# EAGLE schematic KS-SCH-01466-01 OSSAT OBC Dev Board Schematic (EAGLE 9.7.0)
Assembly variants: Main

## Sheet 1 of 6: Block Diagram
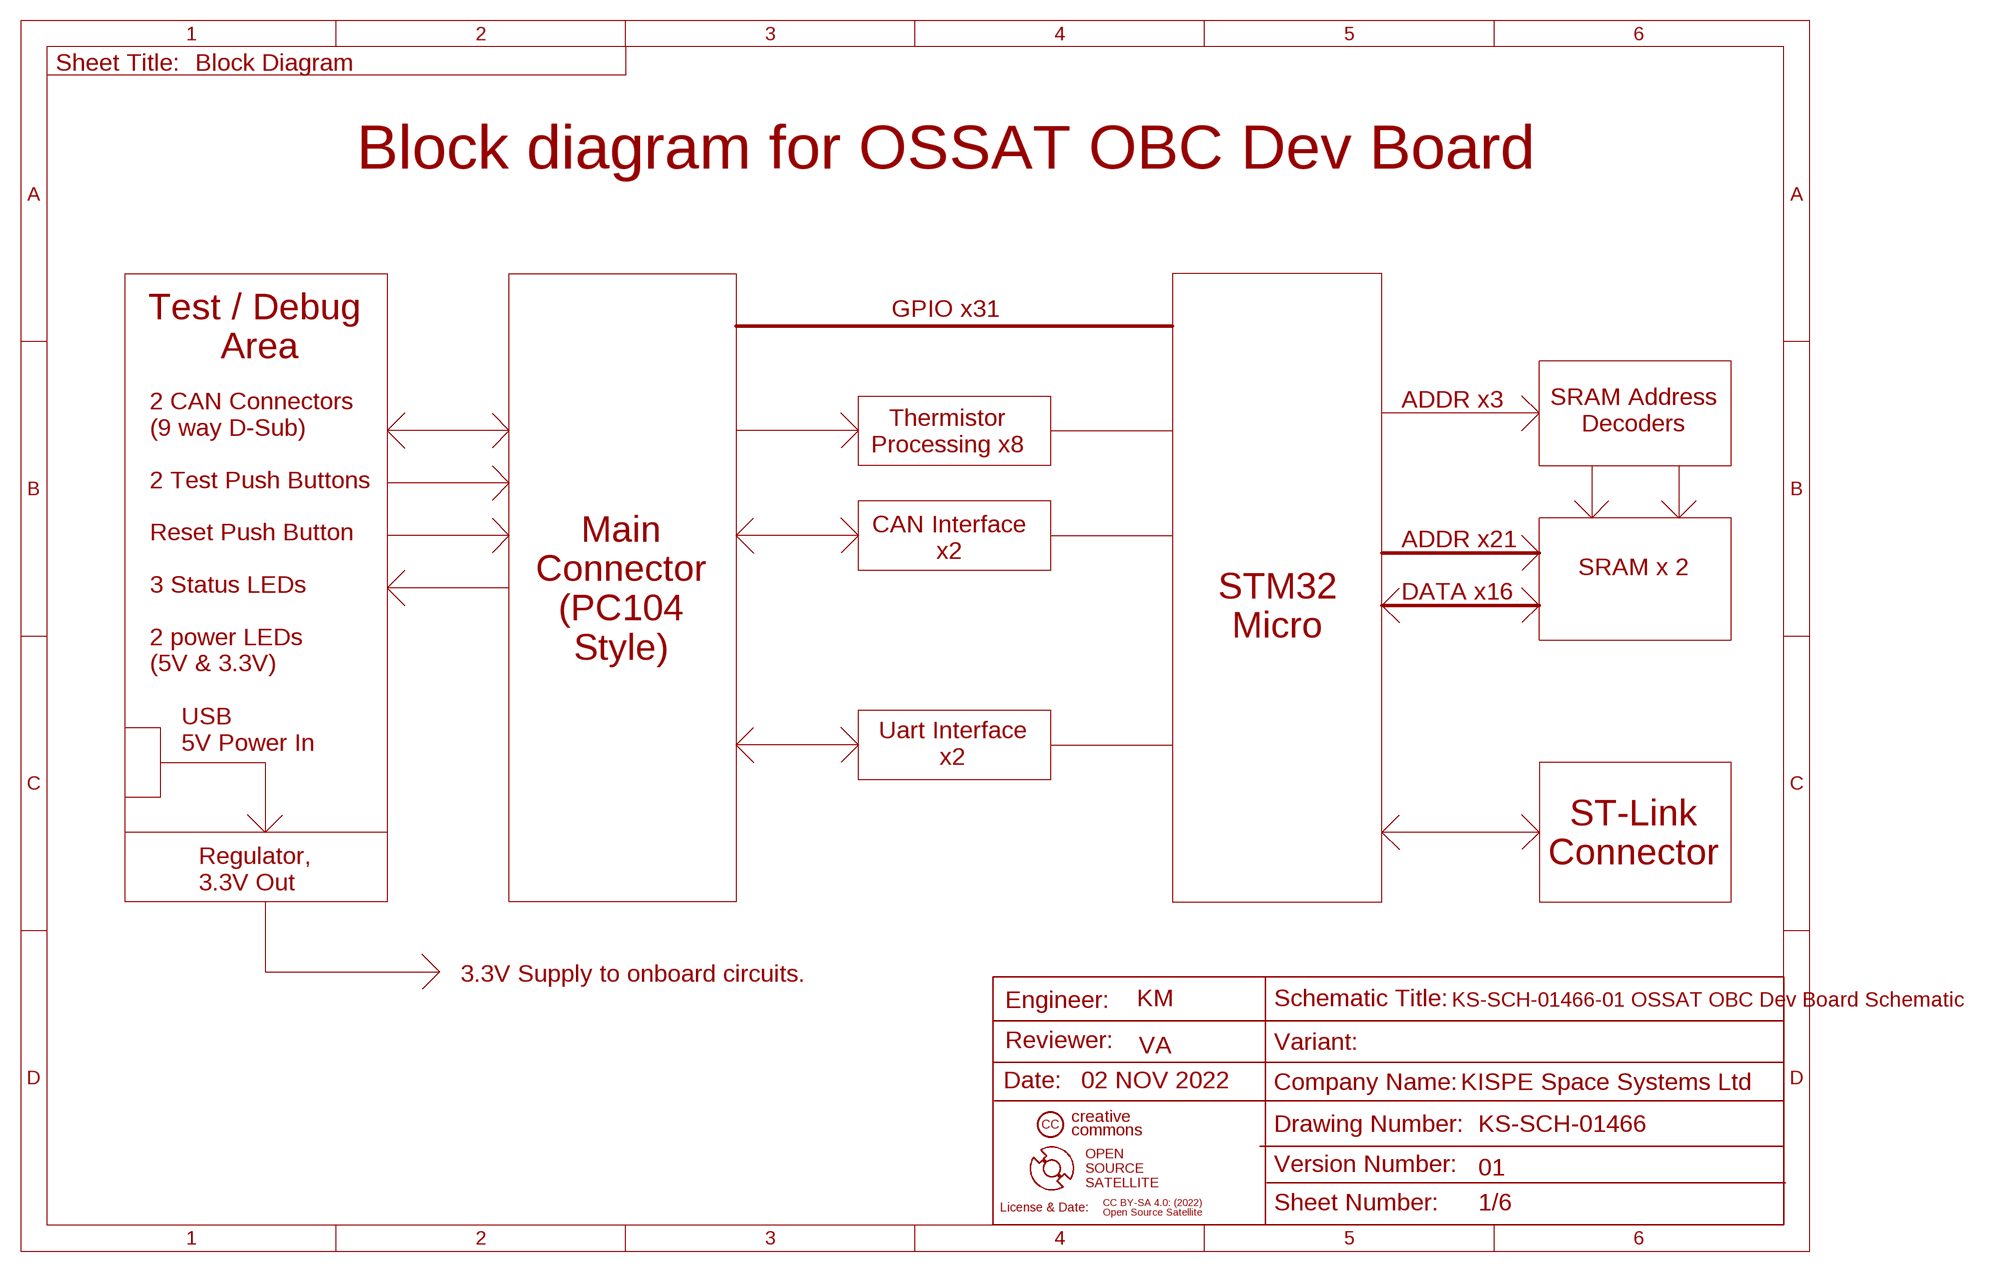
[diagram p0: schematic, sheet 1]
FRAME2 (FRAME_A4_KISPE): LICENSE_DATE: CC BY-SA 4.0: (2022)

### Notes on the sheet
- Block Diagram
- Block diagram for OSSAT OBC Dev Board
- GPIO x31
- Test / Debug
   Area
- 2 CAN Connectors
  (9 way D-Sub)
  
  2 Test Push Buttons
  
  Reset Push Button
  
  3 Status LEDs
  
  2 power LEDs
  (5V & 3.3V)
- ADDR x3
- SRAM Address
  Decoders
- Thermistor
  Processing x8
- CAN Interface
  x2
- ADDR x21
- SRAM x 2
- Main
  Connector
  (PC104
  Style)
- DATA x16
- STM32
  Micro
- USB
  5V Power In
- Uart Interface
  x2
- ST-Link
  Connector
- Regulator,
  3.3V Out
- 3.3V Supply to onboard circuits.
- KM
- VA
- 02 NOV 2022
- creative
  commons
- CC
- KS-SCH-01466
- OPEN
  SOURCE
  SATELLITE
- 01
- Open Source Satellite

## Sheet 2 of 6: Connectors & Misc
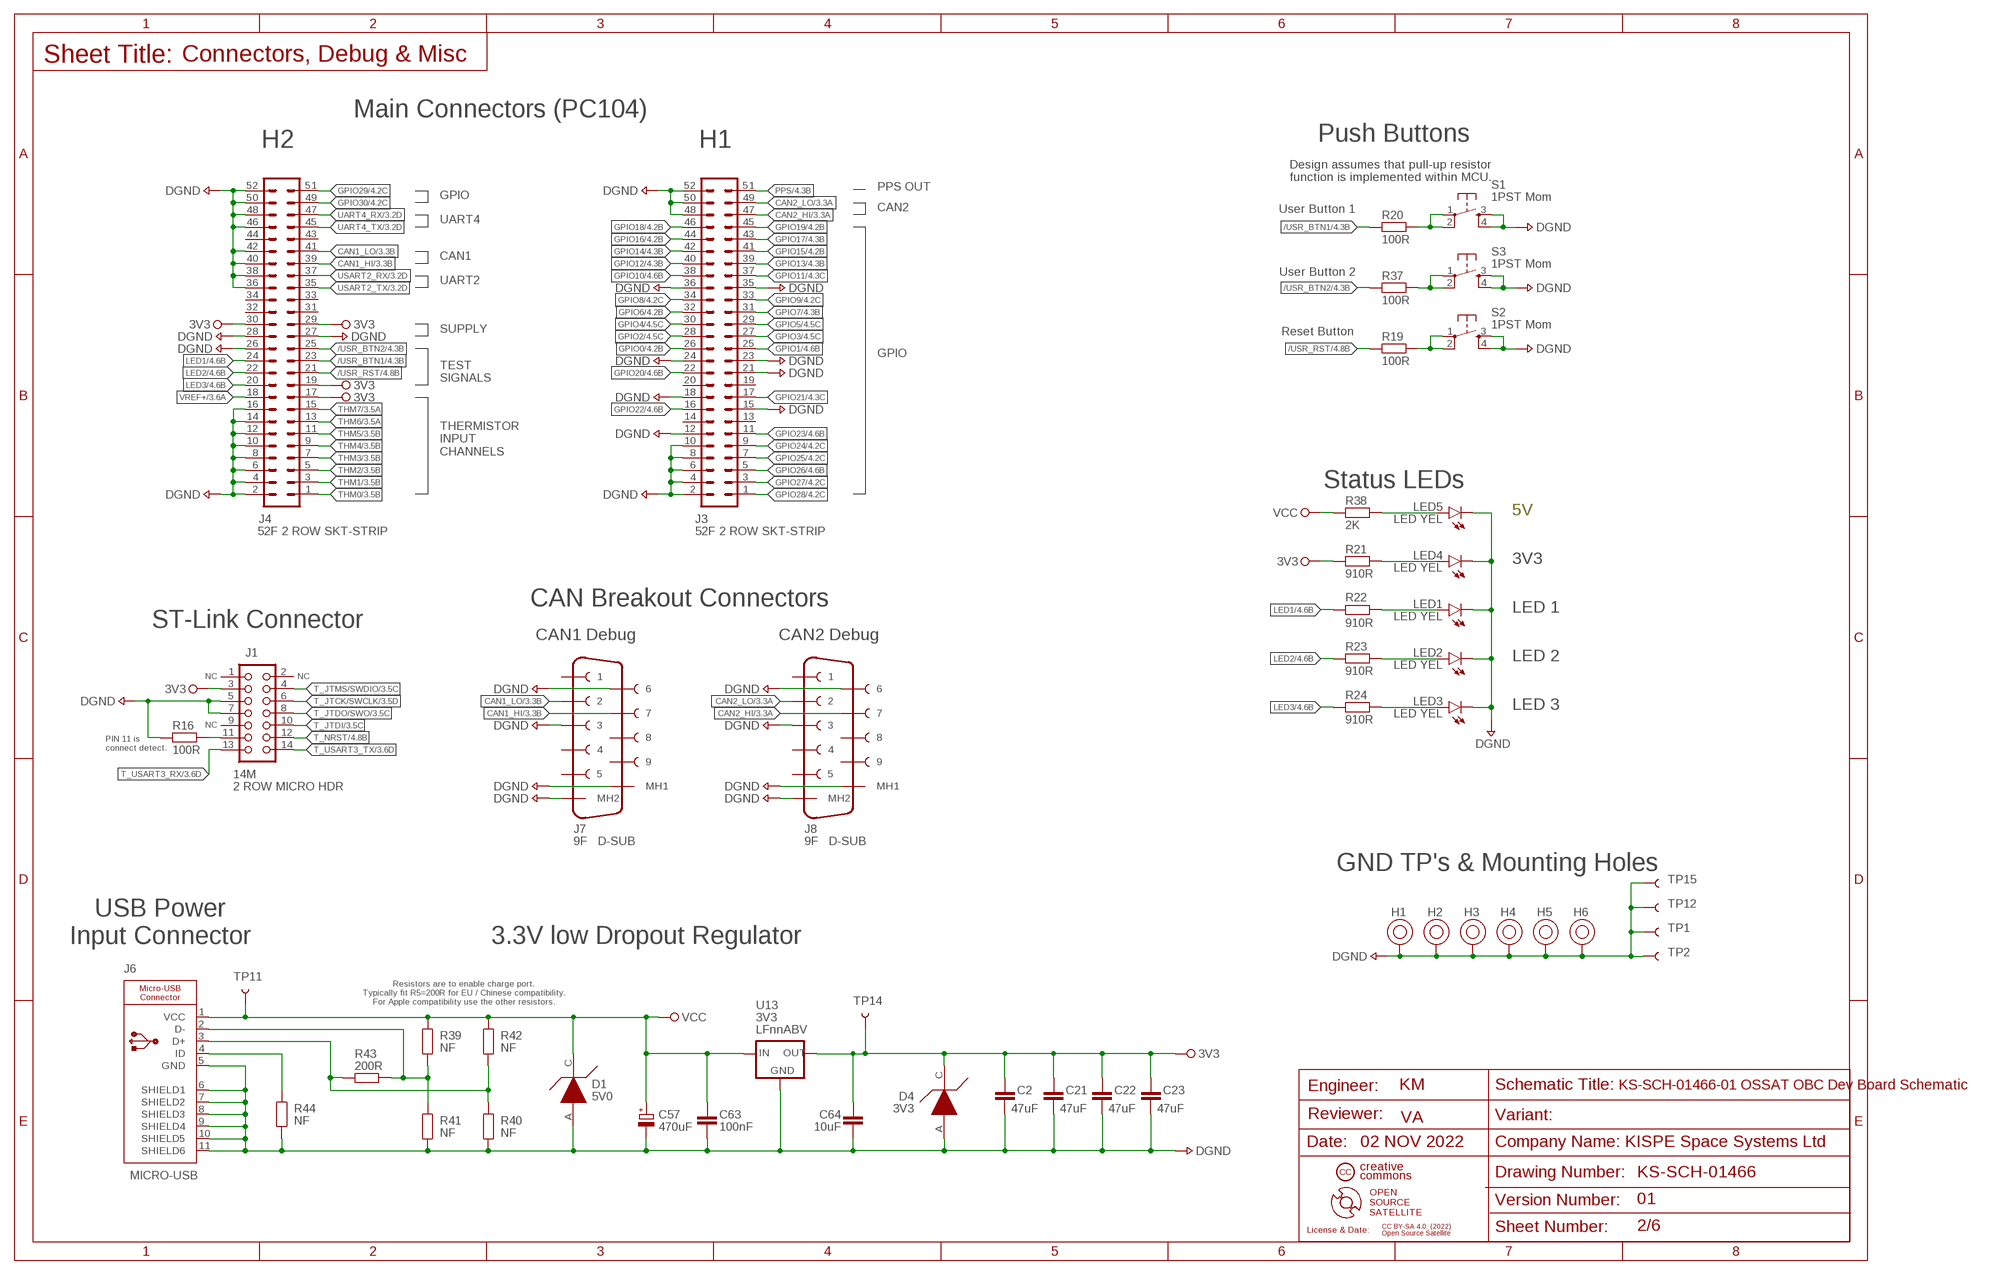
[diagram p1: schematic, sheet 2]
FRAME1 (FRAME_A3_KISPE): LICENSE_DATE: CC BY-SA 4.0: (2022)

### Parts
C2  47uF  CAPD113A_MLCC_1210_X7R_10V_10%  [CAPC3225X135_1210]
C21  47uF  CAPD113A_MLCC_1210_X7R_10V_10%  [CAPC3225X135_1210]
C22  47uF  CAPD113A_MLCC_1210_X7R_10V_10%  [CAPC3225X135_1210]
C23  47uF  CAPD113A_MLCC_1210_X7R_10V_10%  [CAPC3225X135_1210]
C57  470uF  CAPI100A_ELECTROLYTIC_16V_20%_PTH_10D_X12.5H_X5P_RUBYCON_YXF  [CAP_ELECT_RADIAL_D10_H12.5_P5]
C63  100nF  CAPC104A_MLCC_0805_X7R_50V_10%  [CAP_CHIP_0805]
C64  10uF  CAPD111B_MLCC_1210_X7R_25V_10%_Q200  [CAPC3225X135_1210]
D1  5V0  TVSD100A_TVS_CDSOD323-TNN_350W  [SOD323]
D4  3V3  TVSD100A_TVS_CDSOD323-TNN_350W  [SOD323]
H1  NF  MISH100A_HOLE_PTH_3.2_&_6.35  [HOLE-PTH-3.2-6.35]
H2  NF  MISH100A_HOLE_PTH_3.2_&_6.35  [HOLE-PTH-3.2-6.35]
H3  NF  MISH100A_HOLE_PTH_3.2_&_6.35  [HOLE-PTH-3.2-6.35]
H4  NF  MISH100A_HOLE_PTH_3.2_&_6.35  [HOLE-PTH-3.2-6.35]
H5  NF  MISH100A_HOLE_PTH_3.2_&_6.35  [HOLE-PTH-3.2-6.35]
H6  NF  MISH100A_HOLE_PTH_3.2_&_6.35  [HOLE-PTH-3.2-6.35]
J1  14M  CNRP101A_14M_2ROW_MICRO_HEADER_1.27P  [HDRV14W41P127_2X7_FTSH]
J3  52F  CNRP100A_52F_2ROW_SKT-STRIP_2.54P  [HDRVR52W64P254_2X26_6655X495X1105B]
J4  52F  CNRP100A_52F_2ROW_SKT-STRIP_2.54P  [HDRVR52W64P254_2X26_6655X495X1105B]
J6  CNRP105A_MICRO-USB_90DEG  [CON_MICRO_USB_FEMALE]
J7  9F  CNRP102A_9F_D-SUB_VERT_SCW-POST  [LD09S24A4GV00LF]
J8  9F  CNRP102A_9F_D-SUB_VERT_SCW-POST  [LD09S24A4GV00LF]
LED1  OPTL102A_LED_YELLOW_0805_120DEG  [LED_CHIP_0805]
LED2  OPTL102A_LED_YELLOW_0805_120DEG  [LED_CHIP_0805]
LED3  OPTL102A_LED_YELLOW_0805_120DEG  [LED_CHIP_0805]
LED4  OPTL102A_LED_YELLOW_0805_120DEG  [LED_CHIP_0805]
LED5  OPTL102A_LED_YELLOW_0805_120DEG  [LED_CHIP_0805]
R16  100R  RESA103B_RES_0805_0.125W_1%_AEC-Q200  [RES_CHIP_0805]
R19  100R  RESA103B_RES_0805_0.125W_1%_AEC-Q200  [RES_CHIP_0805]
R20  100R  RESA103B_RES_0805_0.125W_1%_AEC-Q200  [RES_CHIP_0805]
R21  910R  RESA103B_RES_0805_0.125W_1%_AEC-Q200  [RES_CHIP_0805]
R22  910R  RESA103B_RES_0805_0.125W_1%_AEC-Q200  [RES_CHIP_0805]
R23  910R  RESA103B_RES_0805_0.125W_1%_AEC-Q200  [RES_CHIP_0805]
R24  910R  RESA103B_RES_0805_0.125W_1%_AEC-Q200  [RES_CHIP_0805]
R37  100R  RESA103B_RES_0805_0.125W_1%_AEC-Q200  [RES_CHIP_0805]
R38  2K  RESA103B_RES_0805_0.125W_1%_AEC-Q200  [RES_CHIP_0805]
R39  NF  RESA103B_RES_0805_0.125W_1%_AEC-Q200  [RES_CHIP_0805]
R40  NF  RESA103B_RES_0805_0.125W_1%_AEC-Q200  [RES_CHIP_0805]
R41  NF  RESA103B_RES_0805_0.125W_1%_AEC-Q200  [RES_CHIP_0805]
R42  NF  RESA103B_RES_0805_0.125W_1%_AEC-Q200  [RES_CHIP_0805]
R43  200R  RESA103B_RES_0805_0.125W_1%_AEC-Q200  [RES_CHIP_0805]
R44  NF  RESA103B_RES_0805_0.125W_1%_AEC-Q200  [RES_CHIP_0805]
S1  SWTA100A_1PST_SMD_MOMENTARY_PUSH-BUTTON  [TACTILE_SWITCH_SMD_5.2MM]
S2  SWTA100A_1PST_SMD_MOMENTARY_PUSH-BUTTON  [TACTILE_SWITCH_SMD_5.2MM]
S3  SWTA100A_1PST_SMD_MOMENTARY_PUSH-BUTTON  [TACTILE_SWITCH_SMD_5.2MM]
TP1  NF  CNRT101A_TEST-POINT_1.02MM_PTH  [TP-40TH]
TP2  NF  CNRT101A_TEST-POINT_1.02MM_PTH  [TP-40TH]
TP11  NF  CNRT101A_TEST-POINT_1.02MM_PTH  [TP-40TH]
TP12  NF  CNRT101A_TEST-POINT_1.02MM_PTH  [TP-40TH]
TP14  NF  CNRT101A_TEST-POINT_1.02MM_PTH  [TP-40TH]
TP15  NF  CNRT101A_TEST-POINT_1.02MM_PTH  [TP-40TH]
U13  3V3  ICTR100A_3V3_LFNNABV_LDO_REGULATOR_TO-220  [TO220L1A]

### Nets
3V3: C2.1 C21.1 C22.1 C23.1 C64.1 D4.C(K) J1.3 J4.17 J4.19 J4.29 J4.30 R21.1 TP14.P$1 U13.3(OUT) ; also sheet 3,4,5
/USR_BTN1: J4.23 R20.2 ; also sheet 4
/USR_BTN2: J4.25 R37.2 ; also sheet 4
/USR_RST: J4.21 R19.2 ; also sheet 4
CAN1_HI: J4.39 J7.7 ; also sheet 3
CAN1_LO: J4.41 J7.2 ; also sheet 3
CAN2_HI: J3.47 J8.7 ; also sheet 3
CAN2_LO: J3.49 J8.2 ; also sheet 3
DGND: C2.2 C21.2 C22.2 C23.2 C57.2(-) C63.2 C64.2 D1.A D4.A H1.P$1 H2.P$1 H3.P$1 H4.P$1 H5.P$1 H6.P$1 J1.5 J1.7 J3.2 J3.4 J3.6 J3.8 J3.10 J3.12 J3.15 J3.18 J3.21 J3.23 J3.24 J3.35 J3.36 J3.48 J3.50 J3.52 J4.2 J4.4 J4.6 J4.8 J4.10 J4.12 J4.14 J4.16 J4.26 J4.27 J4.28 J4.36 J4.38 J4.40 J4.42 J4.46 J4.48 J4.50 J4.52 J6.5(GND) J6.6(SHIELD1) J6.7(SHIELD2) J6.8(SHIELD3) J6.9(SHIELD4) J6.10(SHIELD5) J6.11(SHIELD6) J7.3 J7.6 J7.MH1(MH2) J7.MH2(MH1) J8.3 J8.6 J8.MH1(MH2) J8.MH2(MH1) LED1.C LED2.C LED3.C LED4.C LED5.C R16.1 R40.1 R41.1 R44.1 S1.3 S1.4 S2.3 S2.4 S3.3 S3.4 TP1.P$1 TP2.P$1 TP12.P$1 TP15.P$1 U13.2(GND) ; also sheet 3,4,5
GPIO0: J3.26 ; also sheet 4
GPIO1: J3.25 ; also sheet 4
GPIO2: J3.28 ; also sheet 4
GPIO3: J3.27 ; also sheet 4
GPIO4: J3.30 ; also sheet 4
GPIO5: J3.29 ; also sheet 4
GPIO6: J3.32 ; also sheet 4
GPIO7: J3.31 ; also sheet 4
GPIO8: J3.34 ; also sheet 4
GPIO9: J3.33 ; also sheet 4
GPIO10: J3.38 ; also sheet 4
GPIO11: J3.37 ; also sheet 4
GPIO12: J3.40 ; also sheet 4
GPIO13: J3.39 ; also sheet 4
GPIO14: J3.42 ; also sheet 4
GPIO15: J3.41 ; also sheet 4
GPIO16: J3.44 ; also sheet 4
GPIO17: J3.43 ; also sheet 4
GPIO18: J3.46 ; also sheet 4
GPIO19: J3.45 ; also sheet 4
GPIO20: J3.22 ; also sheet 4
GPIO21: J3.17 ; also sheet 4
GPIO22: J3.16 ; also sheet 4
GPIO23: J3.11 ; also sheet 4
GPIO24: J3.9 ; also sheet 4
GPIO25: J3.7 ; also sheet 4
GPIO26: J3.5 ; also sheet 4
GPIO27: J3.3 ; also sheet 4
GPIO28: J3.1 ; also sheet 4
GPIO29: J4.51 ; also sheet 4
GPIO30: J4.49 ; also sheet 4
LED1: J4.24 R22.1 ; also sheet 4
LED2: J4.22 R23.1 ; also sheet 4
LED3: J4.20 R24.1 ; also sheet 4
N$23: R19.1 S2.1 S2.2
N$29: J1.11 R16.2
N$30: R20.1 S1.1 S1.2
N$32: LED4.A R21.2
N$33: LED1.A R22.2
N$34: LED2.A R23.2
N$35: LED3.A R24.2
N$36: R37.1 S3.1 S3.2
N$37: LED5.A R38.2
N$38: J6.3(D+) R40.2 R42.1 R43.1
N$39: J6.2(D-) R39.1 R41.2 R43.2
N$40: J6.4(ID) R44.2
PPS: J3.51 ; also sheet 4
T_JTCK/SWCLK: J1.6 ; also sheet 3,4
T_JTDI: J1.10 ; also sheet 3,4
T_JTDO/SWO: J1.8 ; also sheet 3
T_JTMS/SWDIO: J1.4 ; also sheet 3,4
T_NRST: J1.12 ; also sheet 4
T_USART3_RX: J1.13 ; also sheet 3,4
T_USART3_TX: J1.14 ; also sheet 3
THM0: J4.1 ; also sheet 3
THM1: J4.3 ; also sheet 3
THM2: J4.5 ; also sheet 3
THM3: J4.7 ; also sheet 3
THM4: J4.9 ; also sheet 3
THM5: J4.11 ; also sheet 3
THM6: J4.13 ; also sheet 3
THM7: J4.15 ; also sheet 3
UART4_RX: J4.47 ; also sheet 3,4
UART4_TX: J4.45 ; also sheet 3
USART2_RX: J4.37 ; also sheet 3,4
USART2_TX: J4.35 ; also sheet 3
VCC [MRAM Bus]: C57.1(+) C63.1 D1.C(K) J6.1(VCC) R38.1 R39.2 R42.2 TP11.P$1 U13.1(IN)
VREF+ [Vref]: J4.18 ; also sheet 3,4
Unconnected: J1.1 J1.2 J1.9 J3.13 J3.14 J3.19 J3.20 J4.31 J4.32 J4.33 J4.34 J4.43 J4.44 J7.1 J7.4 J7.5 J7.8 J7.9 J8.1 J8.4 J8.5 J8.8 J8.9

### Notes on the sheet
- Connectors, Debug & Misc
- Main Connectors (PC104)
- H2 | H1
- Push Buttons
- Design assumes that pull-up resistor
  function is implemented within MCU.
- GPIO | PPS OUT
- CAN2
- UART4 | User Button 1
- CAN1
- UART2 | User Button 2
- SUPPLY
- Reset Button
- GPIO
- TEST
  SIGNALS
- THERMISTOR
  INPUT
  CHANNELS
- Status LEDs
- 5V
- 3V3
- CAN Breakout Connectors
- LED 1
- ST-Link Connector
- CAN1 Debug | CAN2 Debug
- LED 2
- NC | NC
- LED 3
- NC
- PIN 11 is
  connect detect.
- GND TP's & Mounting Holes
- USB Power
  Input Connector
- 3.3V low Dropout Regulator
- Resistors are to enable charge port.
  Typically fit R5=200R for EU / Chinese compatibility.
  For Apple compatibility use the other resistors.
- KM
- VA
- 02 NOV 2022
- creative
  commons
- CC
- KS-SCH-01466
- OPEN
  SOURCE
  SATELLITE
- 01
- Open Source Satellite

## Sheet 3 of 6: Sub-System Busses
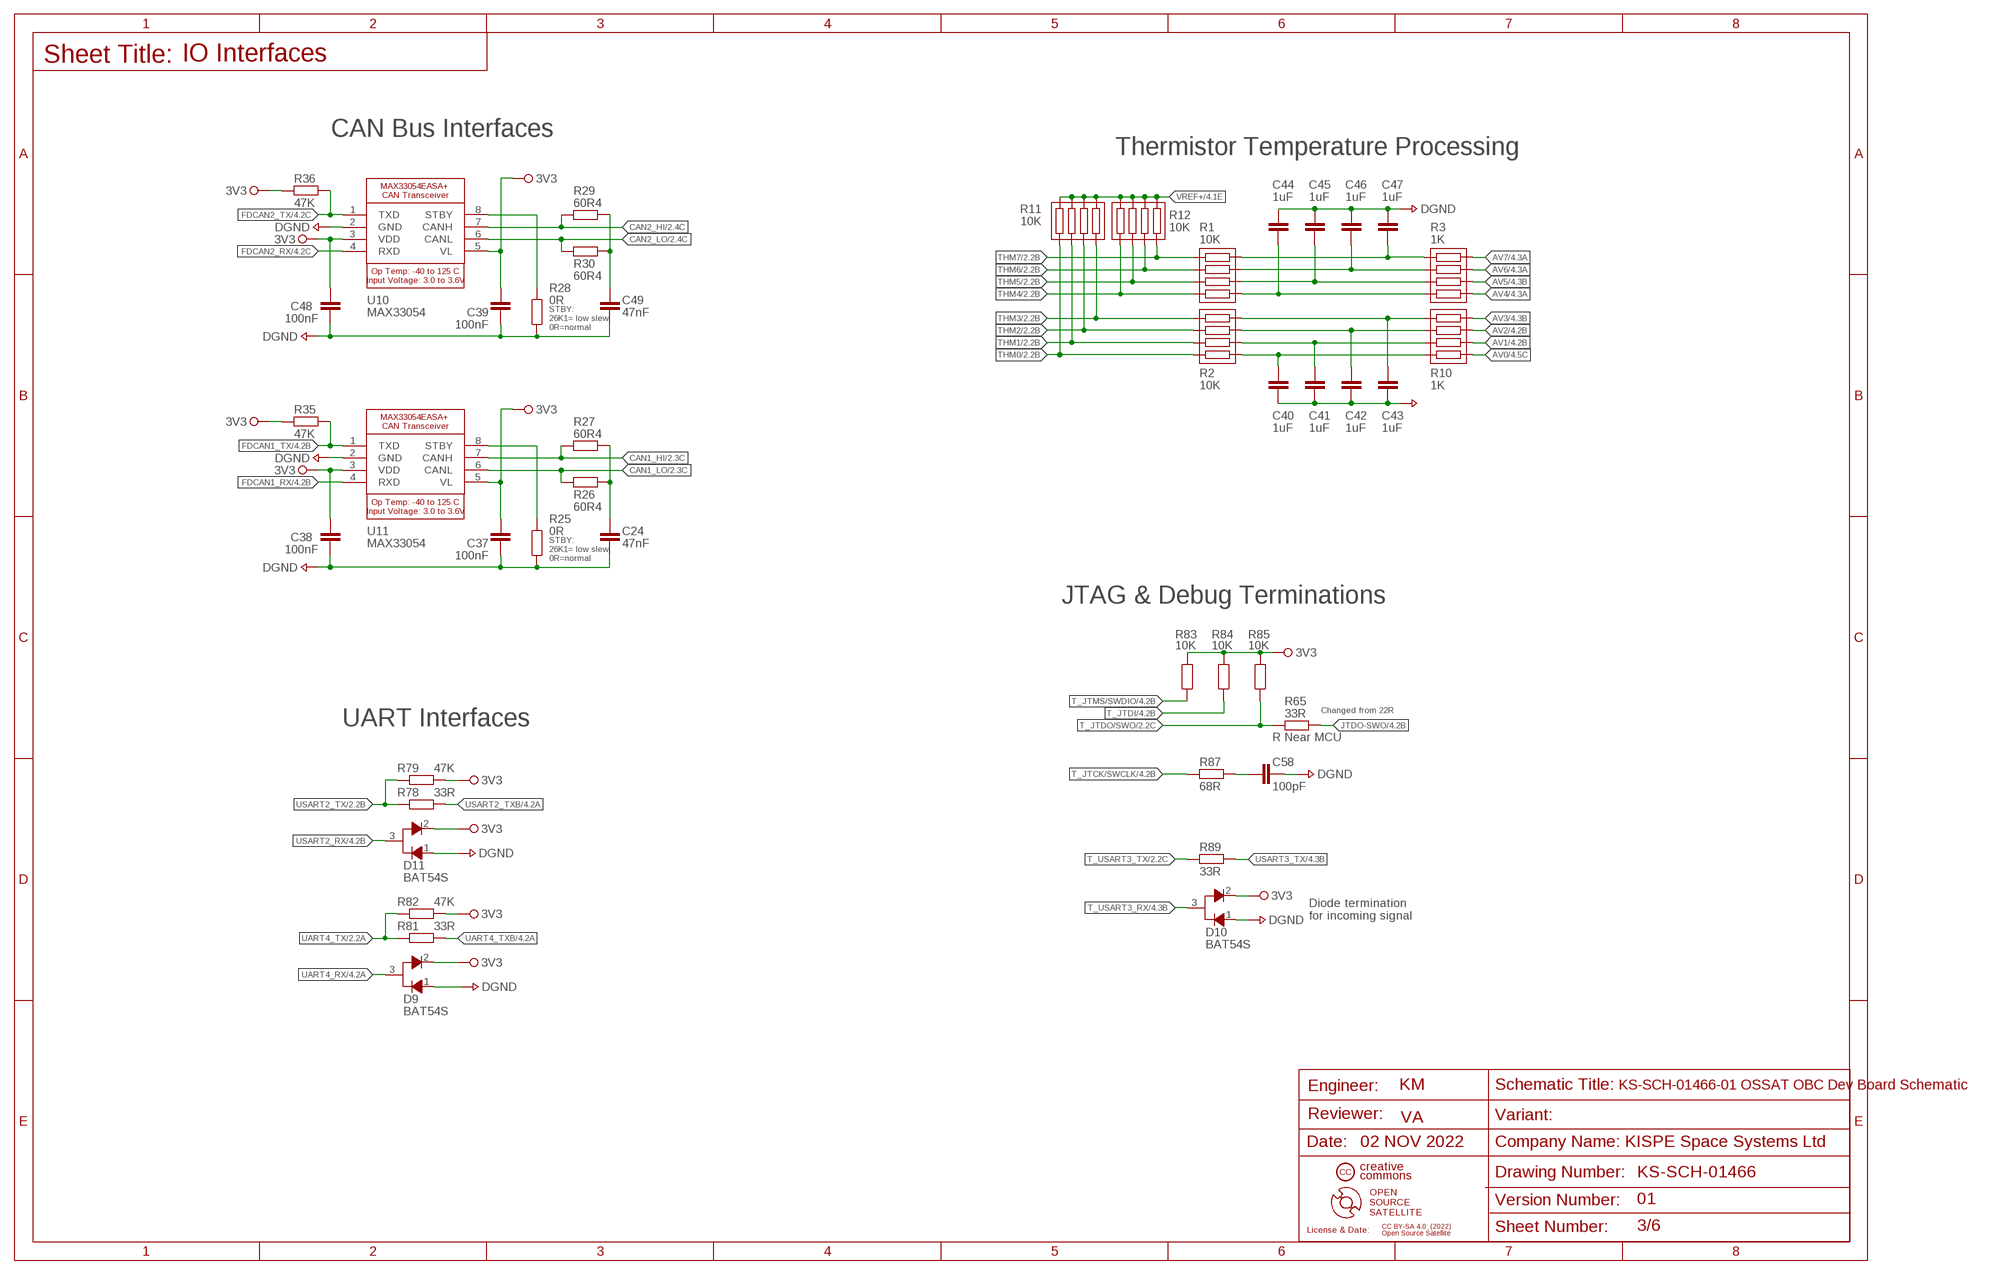
[diagram p2: schematic, sheet 3]
FRAME7 (FRAME_A3_KISPE): LICENSE_DATE: CC BY-SA 4.0: (2022)

### Parts
C24  47nF  CAPC104B_MLCC_0805_X7R_50V_10%_Q200  [CAP_CHIP_0805]
C37  100nF  CAPC104A_MLCC_0805_X7R_50V_10%  [CAP_CHIP_0805]
C38  100nF  CAPC104A_MLCC_0805_X7R_50V_10%  [CAP_CHIP_0805]
C39  100nF  CAPC104A_MLCC_0805_X7R_50V_10%  [CAP_CHIP_0805]
C40  1uF  CAPD101A_MLCC_0805_X7R_25V_10%  [CAP_CHIP_0805]
C41  1uF  CAPD101A_MLCC_0805_X7R_25V_10%  [CAP_CHIP_0805]
C42  1uF  CAPD101A_MLCC_0805_X7R_25V_10%  [CAP_CHIP_0805]
C43  1uF  CAPD101A_MLCC_0805_X7R_25V_10%  [CAP_CHIP_0805]
C44  1uF  CAPD101A_MLCC_0805_X7R_25V_10%  [CAP_CHIP_0805]
C45  1uF  CAPD101A_MLCC_0805_X7R_25V_10%  [CAP_CHIP_0805]
C46  1uF  CAPD101A_MLCC_0805_X7R_25V_10%  [CAP_CHIP_0805]
C47  1uF  CAPD101A_MLCC_0805_X7R_25V_10%  [CAP_CHIP_0805]
C48  100nF  CAPC104A_MLCC_0805_X7R_50V_10%  [CAP_CHIP_0805]
C49  47nF  CAPC104B_MLCC_0805_X7R_50V_10%_Q200  [CAP_CHIP_0805]
C58  100pF  CAPA102A_MLCC_0805_COG_50V_5%  [CAP_CHIP_0805]
D9  DIOC100A_BAT54S_DUAL_SCHOTTKY  [SOT23]
D10  DIOC100A_BAT54S_DUAL_SCHOTTKY  [SOT23]
D11  DIOC100A_BAT54S_DUAL_SCHOTTKY  [SOT23]
R1  10K  RESB100B_RES_4-ISOLATED_1206_1%_Q200  [RESCAXS80P320X160X60-8N]
R2  10K  RESB100B_RES_4-ISOLATED_1206_1%_Q200  [RESCAXS80P320X160X60-8N]
R3  1K  RESB100B_RES_4-ISOLATED_1206_1%_Q200  [RESCAXS80P320X160X60-8N]
R10  1K  RESB100B_RES_4-ISOLATED_1206_1%_Q200  [RESCAXS80P320X160X60-8N]
R11  10K  RESB100B_RES_4-ISOLATED_1206_1%_Q200  [RESCAXS80P320X160X60-8N]
R12  10K  RESB100B_RES_4-ISOLATED_1206_1%_Q200  [RESCAXS80P320X160X60-8N]
R25  0R  RESA101A_RES_0805_LINK_2A  [RES_CHIP_0805]
R26  60R4  RESA103B_RES_0805_0.125W_1%_AEC-Q200  [RES_CHIP_0805]
R27  60R4  RESA103B_RES_0805_0.125W_1%_AEC-Q200  [RES_CHIP_0805]
R28  0R  RESA101A_RES_0805_LINK_2A  [RES_CHIP_0805]
R29  60R4  RESA103B_RES_0805_0.125W_1%_AEC-Q200  [RES_CHIP_0805]
R30  60R4  RESA103B_RES_0805_0.125W_1%_AEC-Q200  [RES_CHIP_0805]
R35  47K  RESA103B_RES_0805_0.125W_1%_AEC-Q200  [RES_CHIP_0805]
R36  47K  RESA103B_RES_0805_0.125W_1%_AEC-Q200  [RES_CHIP_0805]
R65  33R  RESA103B_RES_0805_0.125W_1%_AEC-Q200  [RES_CHIP_0805]
R78  33R  RESA103B_RES_0805_0.125W_1%_AEC-Q200  [RES_CHIP_0805]
R79  47K  RESA103B_RES_0805_0.125W_1%_AEC-Q200  [RES_CHIP_0805]
R81  33R  RESA103B_RES_0805_0.125W_1%_AEC-Q200  [RES_CHIP_0805]
R82  47K  RESA103B_RES_0805_0.125W_1%_AEC-Q200  [RES_CHIP_0805]
R83  10K  RESA103B_RES_0805_0.125W_1%_AEC-Q200  [RES_CHIP_0805]
R84  10K  RESA103B_RES_0805_0.125W_1%_AEC-Q200  [RES_CHIP_0805]
R85  10K  RESA103B_RES_0805_0.125W_1%_AEC-Q200  [RES_CHIP_0805]
R87  68R  RESA103B_RES_0805_0.125W_1%_AEC-Q200  [RES_CHIP_0805]
R89  33R  RESA103B_RES_0805_0.125W_1%_AEC-Q200  [RES_CHIP_0805]
U10  ICTT100A_MAX33054EASA+_CAN-TRANCEIVER  [IC_MAX33054EASA+]
U11  ICTT100A_MAX33054EASA+_CAN-TRANCEIVER  [IC_MAX33054EASA+]

### Nets
3V3: C37.2 C38.2 C39.2 C48.2 D9.2 D10.2 D11.2 R35.2 R36.2 R79.2 R82.2 R83.2 R84.2 R85.2 U10.3(VDD) U10.5(VL) U11.3(VDD) U11.5(VL) ; also sheet 2,4,5
AV0: R10.5 ; also sheet 4
AV1: R10.6 ; also sheet 4
AV2: R10.7 ; also sheet 4
AV3: R10.8 ; also sheet 4
AV4: R3.5 ; also sheet 4
AV5: R3.6 ; also sheet 4
AV6: R3.7 ; also sheet 4
AV7: R3.8 ; also sheet 4
CAN1_HI: R27.1 U11.7(CANH) ; also sheet 2
CAN1_LO: R26.1 U11.6(CANL) ; also sheet 2
CAN2_HI: R29.1 U10.7(CANH) ; also sheet 2
CAN2_LO: R30.1 U10.6(CANL) ; also sheet 2
DGND: C24.1 C37.1 C38.1 C39.1 C40.2 C41.2 C42.2 C43.2 C44.1 C45.1 C46.1 C47.1 C48.1 C49.1 C58.2 D9.1 D10.1 D11.1 R25.1 R28.1 U10.2(GND) U11.2(GND) ; also sheet 2,4,5
FDCAN1_RX: U11.4(RXD) ; also sheet 4
FDCAN1_TX: R35.1 U11.1(TXD) ; also sheet 4
FDCAN2_RX: U10.4(RXD) ; also sheet 4
FDCAN2_TX: R36.1 U10.1(TXD) ; also sheet 4
JTDO-SWO: R65.2 ; also sheet 4
L_CSN+1: C40.1 R2.5 R10.4
L_CSN+10: C41.1 R2.6 R10.3
L_CSN+11: C42.1 R2.7 R10.2
L_CSN+12: C43.1 R2.8 R10.1
L_CSN+13: C44.2 R1.5 R3.4
L_CSN+14: C45.2 R1.6 R3.3
L_CSN+15: C46.2 R1.7 R3.2
L_CSN+16: C47.2 R1.8 R3.1
N$15: C58.1 R87.2
N$25: C24.2 R26.2 R27.2
N$26: R25.2 U11.8(STBY)
N$27: R28.2 U10.8(STBY)
N$28: C49.2 R29.2 R30.2
T_JTCK/SWCLK: R87.1 ; also sheet 2,4
T_JTDI: R84.1 ; also sheet 2,4
T_JTDO/SWO: R65.1 R85.1 ; also sheet 2
T_JTMS/SWDIO: R83.1 ; also sheet 2,4
T_USART3_RX: D10.3 ; also sheet 2,4
T_USART3_TX: R89.1 ; also sheet 2
THM0: R2.4 R11.5 ; also sheet 2
THM1: R2.3 R11.6 ; also sheet 2
THM2: R2.2 R11.7 ; also sheet 2
THM3: R2.1 R11.8 ; also sheet 2
THM4: R1.4 R12.5 ; also sheet 2
THM5: R1.3 R12.6 ; also sheet 2
THM6: R1.2 R12.7 ; also sheet 2
THM7: R1.1 R12.8 ; also sheet 2
UART4_RX: D9.3 ; also sheet 2,4
UART4_TX: R81.1 R82.1 ; also sheet 2
UART4_TXB: R81.2 ; also sheet 4
USART2_RX: D11.3 ; also sheet 2,4
USART2_TX: R78.1 R79.1 ; also sheet 2
USART2_TXB: R78.2 ; also sheet 4
USART3_TX: R89.2 ; also sheet 4
VREF+ [Vref]: R11.1 R11.2 R11.3 R11.4 R12.1 R12.2 R12.3 R12.4 ; also sheet 2,4

### Notes on the sheet
- IO Interfaces
- CAN Bus Interfaces
- Thermistor Temperature Processing
- STBY:
  26K1= low slew 
  0R=normal
- STBY:
  26K1= low slew 
  0R=normal
- JTAG & Debug Terminations
- Changed from 22R
- UART Interfaces
- R Near MCU
- Diode termination
  for incoming signal
- KM
- VA
- 02 NOV 2022
- creative
  commons
- CC
- KS-SCH-01466
- OPEN
  SOURCE
  SATELLITE
- 01
- Open Source Satellite

## Sheet 4 of 6: MCU
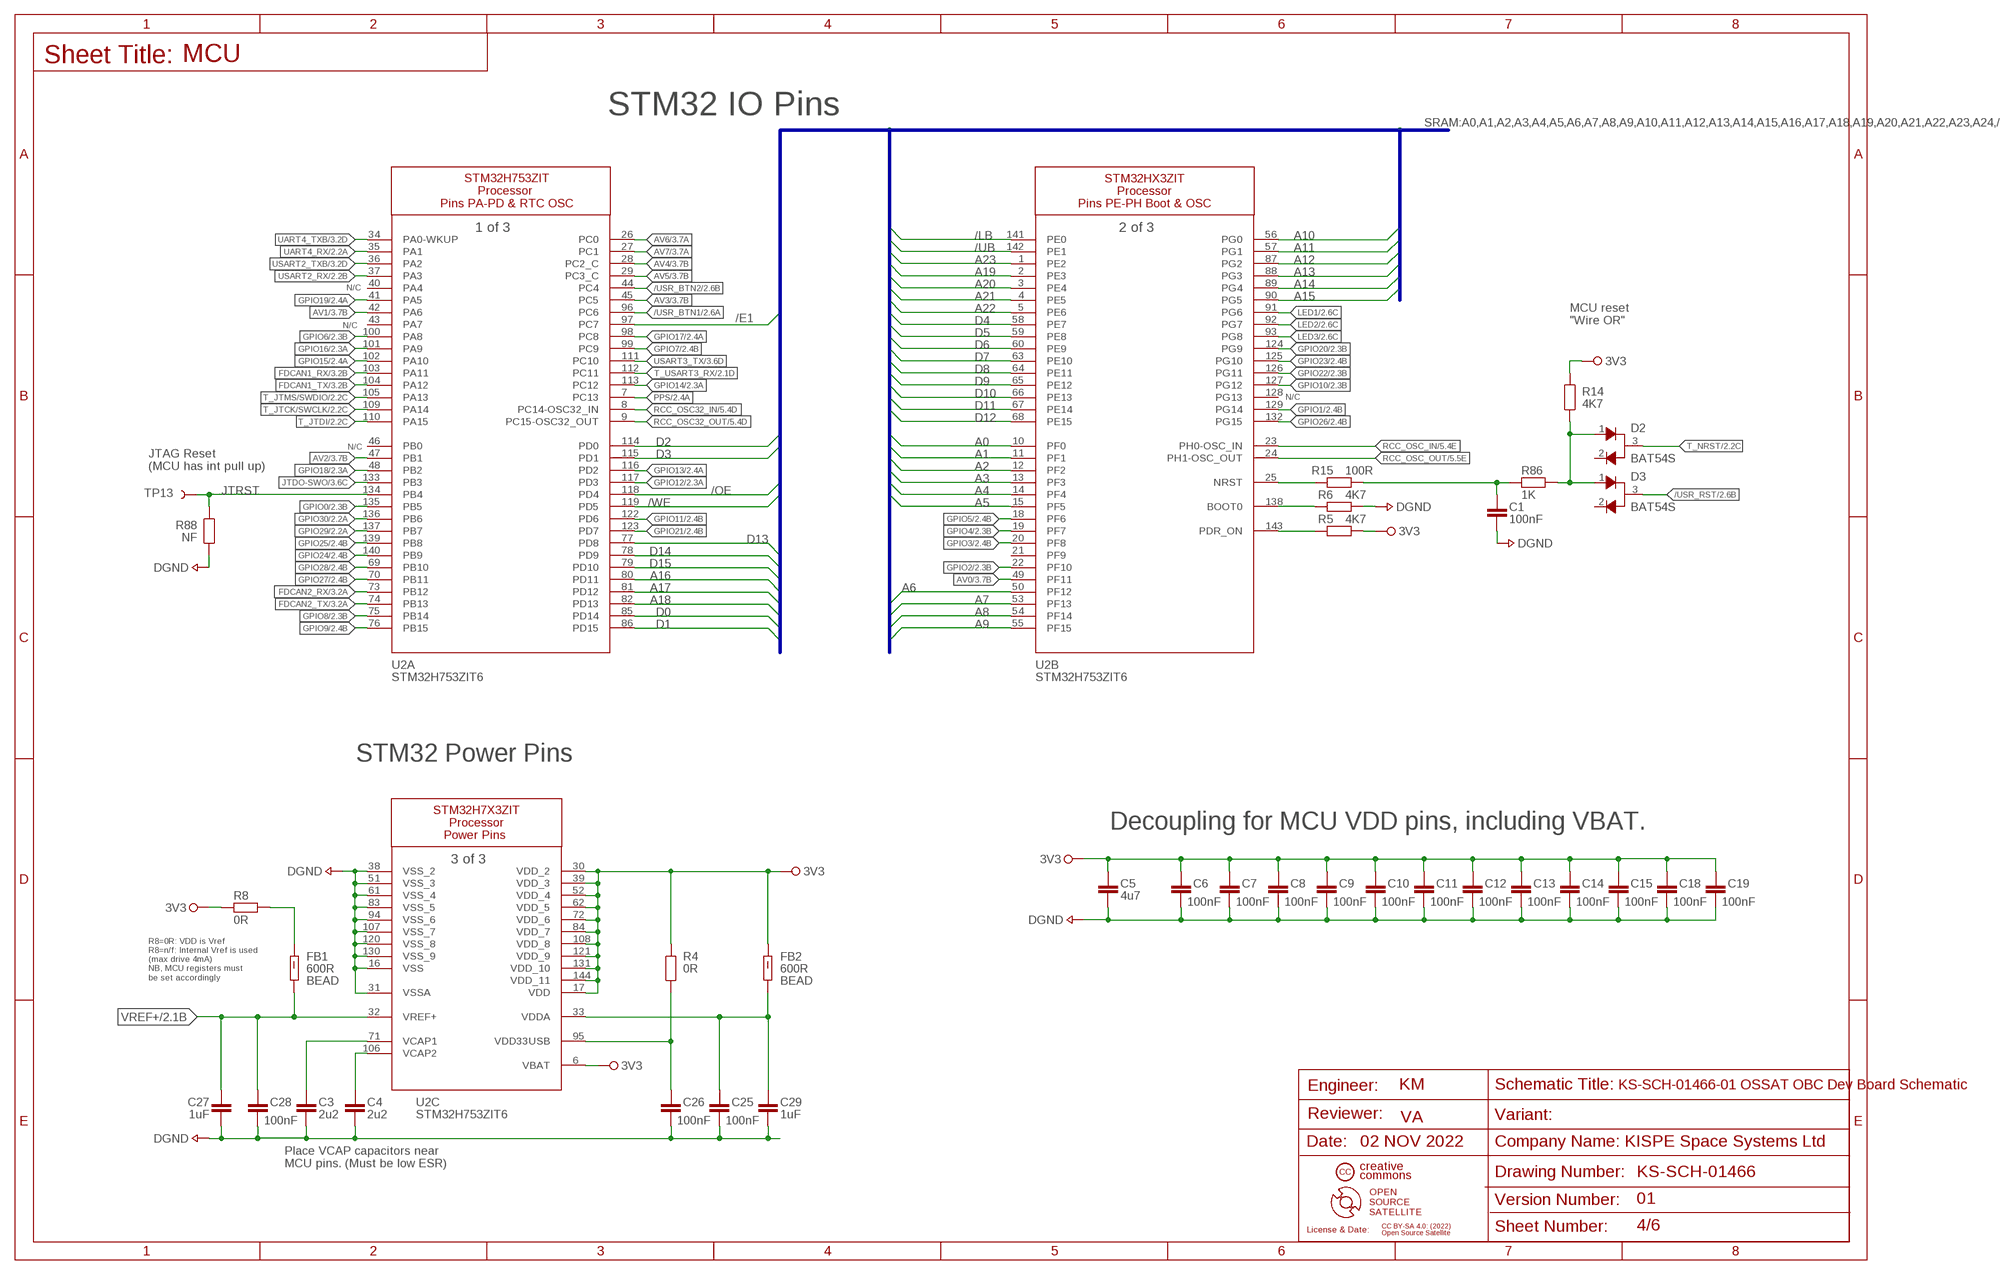
[diagram p3: schematic, sheet 4]
FRAME6 (FRAME_A3_KISPE): LICENSE_DATE: CC BY-SA 4.0: (2022)

### Parts
C1  100nF  CAPC104A_MLCC_0805_X7R_50V_10%  [CAP_CHIP_0805]
C3  2u2  CAPD102B_MLCC_0805_X7R_16V_10%_Q200  [CAP_CHIP_0805]
C4  2u2  CAPD102B_MLCC_0805_X7R_16V_10%_Q200  [CAP_CHIP_0805]
C5  4u7  CAPD102A_MLCC_0805_X7R_16V_10%  [CAP_CHIP_0805]
C6  100nF  CAPC104A_MLCC_0805_X7R_50V_10%  [CAP_CHIP_0805]
C7  100nF  CAPC104A_MLCC_0805_X7R_50V_10%  [CAP_CHIP_0805]
C8  100nF  CAPC104A_MLCC_0805_X7R_50V_10%  [CAP_CHIP_0805]
C9  100nF  CAPC104A_MLCC_0805_X7R_50V_10%  [CAP_CHIP_0805]
C10  100nF  CAPC104A_MLCC_0805_X7R_50V_10%  [CAP_CHIP_0805]
C11  100nF  CAPC104A_MLCC_0805_X7R_50V_10%  [CAP_CHIP_0805]
C12  100nF  CAPC104A_MLCC_0805_X7R_50V_10%  [CAP_CHIP_0805]
C13  100nF  CAPC104A_MLCC_0805_X7R_50V_10%  [CAP_CHIP_0805]
C14  100nF  CAPC104A_MLCC_0805_X7R_50V_10%  [CAP_CHIP_0805]
C15  100nF  CAPC104A_MLCC_0805_X7R_50V_10%  [CAP_CHIP_0805]
C18  100nF  CAPC104A_MLCC_0805_X7R_50V_10%  [CAP_CHIP_0805]
C19  100nF  CAPC104A_MLCC_0805_X7R_50V_10%  [CAP_CHIP_0805]
C25  100nF  CAPC104A_MLCC_0805_X7R_50V_10%  [CAP_CHIP_0805]
C26  100nF  CAPC104A_MLCC_0805_X7R_50V_10%  [CAP_CHIP_0805]
C27  1uF  CAPD101A_MLCC_0805_X7R_25V_10%  [CAP_CHIP_0805]
C28  100nF  CAPC104A_MLCC_0805_X7R_50V_10%  [CAP_CHIP_0805]
C29  1uF  CAPD101A_MLCC_0805_X7R_25V_10%  [CAP_CHIP_0805]
D2  DIOC100A_BAT54S_DUAL_SCHOTTKY  [SOT23]
D3  DIOC100A_BAT54S_DUAL_SCHOTTKY  [SOT23]
FB1  600R  MAGB100A_BEAD_0805_600R  [BEADC2012X105N]
FB2  600R  MAGB100A_BEAD_0805_600R  [BEADC2012X105N]
R4  0R  RESA101A_RES_0805_LINK_2A  [RES_CHIP_0805]
R5  4K7  RESA103B_RES_0805_0.125W_1%_AEC-Q200  [RES_CHIP_0805]
R6  4K7  RESA103B_RES_0805_0.125W_1%_AEC-Q200  [RES_CHIP_0805]
R8  0R  RESA101A_RES_0805_LINK_2A  [RES_CHIP_0805]
R14  4K7  RESA103B_RES_0805_0.125W_1%_AEC-Q200  [RES_CHIP_0805]
R15  100R  RESA103B_RES_0805_0.125W_1%_AEC-Q200  [RES_CHIP_0805]
R86  1K  RESA103B_RES_0805_0.125W_1%_AEC-Q200  [RES_CHIP_0805]
R88  NF  RESA103B_RES_0805_0.125W_1%_AEC-Q200  [RES_CHIP_0805]
TP13  NF  CNRT101A_TEST-POINT_1.02MM_PTH  [TP-40TH]
U2  ICTP100A_STM32H753ZIT6_MCU_144PIN  [IC_STM32H753ZIT6]

### Nets
3V3: C5.1 C6.1 C7.1 C8.1 C9.1 C10.1 C11.1 C12.1 C13.1 C14.1 C15.1 C18.1 C19.1 FB2.2 R4.2 R5.1 R8.2 R14.1 U2.6(C:VBAT) U2.17(C:VDD) U2.30(C:VDD_2) U2.39(C:VDD_3) U2.52(C:VDD_4) U2.62(C:VDD_5) U2.72(C:VDD_6) U2.84(C:VDD_7) U2.108(C:VDD_8) U2.121(C:VDD_9) U2.131(C:VDD_10) U2.144(C:VDD_11) ; also sheet 2,3,5
/E1 [MRAM Bus]: U2.97(A:PC7) ; also sheet 5
/LB [MRAM Bus]: U2.141(B:PE0) ; also sheet 5
/OE [MRAM Bus]: U2.118(A:PD4) ; also sheet 5
/UB [MRAM Bus]: U2.142(B:PE1) ; also sheet 5
/USR_BTN1: U2.96(A:PC6) ; also sheet 2
/USR_BTN2: U2.44(A:PC4) ; also sheet 2
/USR_RST: D3.3 ; also sheet 2
/WE [MRAM Bus]: U2.119(A:PD5) ; also sheet 5
A0 [MRAM Bus]: U2.10(B:PF0) ; also sheet 5
A1 [MRAM Bus]: U2.11(B:PF1) ; also sheet 5
A2 [MRAM Bus]: U2.12(B:PF2) ; also sheet 5
A3 [MRAM Bus]: U2.13(B:PF3) ; also sheet 5
A4 [MRAM Bus]: U2.14(B:PF4) ; also sheet 5
A5 [MRAM Bus]: U2.15(B:PF5) ; also sheet 5
A6 [MRAM Bus]: U2.50(B:PF12) ; also sheet 5
A7 [MRAM Bus]: U2.53(B:PF13) ; also sheet 5
A8 [MRAM Bus]: U2.54(B:PF14) ; also sheet 5
A9 [MRAM Bus]: U2.55(B:PF15) ; also sheet 5
A10 [MRAM Bus]: U2.56(B:PG0) ; also sheet 5
A11 [MRAM Bus]: U2.57(B:PG1) ; also sheet 5
A12 [MRAM Bus]: U2.87(B:PG2) ; also sheet 5
A13 [MRAM Bus]: U2.88(B:PG3) ; also sheet 5
A14 [MRAM Bus]: U2.89(B:PG4) ; also sheet 5
A15 [MRAM Bus]: U2.90(B:PG5) ; also sheet 5
A16 [MRAM Bus]: U2.80(A:PD11) ; also sheet 5
A17 [MRAM Bus]: U2.81(A:PD12) ; also sheet 5
A18 [MRAM Bus]: U2.82(A:PD13) ; also sheet 5
A19 [MRAM Bus]: U2.2(B:PE3) ; also sheet 5
A20 [MRAM Bus]: U2.3(B:PE4) ; also sheet 5
A21 [MRAM Bus]: U2.4(B:PE5) ; also sheet 5
A22 [MRAM Bus]: U2.5(B:PE6) ; also sheet 5
A23 [MRAM Bus]: U2.1(B:PE2) ; also sheet 5
AV0: U2.49(B:PF11) ; also sheet 3
AV1: U2.42(A:PA6) ; also sheet 3
AV2: U2.47(A:PB1) ; also sheet 3
AV3: U2.45(A:PC5) ; also sheet 3
AV4: U2.28(A:PC2_C) ; also sheet 3
AV5: U2.29(A:PC3_C) ; also sheet 3
AV6: U2.26(A:PC0) ; also sheet 3
AV7: U2.27(A:PC1) ; also sheet 3
BOOT0: R6.2 U2.138(B:BOOT0)
D0 [MRAM Bus]: U2.85(A:PD14) ; also sheet 5
D1 [MRAM Bus]: U2.86(A:PD15) ; also sheet 5
D2 [MRAM Bus]: U2.114(A:PD0) ; also sheet 5
D3 [MRAM Bus]: U2.115(A:PD1) ; also sheet 5
D4 [MRAM Bus]: U2.58(B:PE7) ; also sheet 5
D5 [MRAM Bus]: U2.59(B:PE8) ; also sheet 5
D6 [MRAM Bus]: U2.60(B:PE9) ; also sheet 5
D7 [MRAM Bus]: U2.63(B:PE10) ; also sheet 5
D8 [MRAM Bus]: U2.64(B:PE11) ; also sheet 5
D9 [MRAM Bus]: U2.65(B:PE12) ; also sheet 5
D10 [MRAM Bus]: U2.66(B:PE13) ; also sheet 5
D11 [MRAM Bus]: U2.67(B:PE14) ; also sheet 5
D12 [MRAM Bus]: U2.68(B:PE15) ; also sheet 5
D13 [MRAM Bus]: U2.77(A:PD8) ; also sheet 5
D14 [MRAM Bus]: U2.78(A:PD9) ; also sheet 5
D15 [MRAM Bus]: U2.79(A:PD10) ; also sheet 5
DGND: C1.2 C3.2 C4.2 C5.2 C6.2 C7.2 C8.2 C9.2 C10.2 C11.2 C12.2 C13.2 C14.2 C15.2 C18.2 C19.2 C25.2 C26.2 C27.2 C28.2 C29.2 R6.1 R88.1 U2.16(C:VSS) U2.31(C:VSSA) U2.38(C:VSS_2) U2.51(C:VSS_3) U2.61(C:VSS_4) U2.83(C:VSS_5) U2.94(C:VSS_6) U2.107(C:VSS_7) U2.120(C:VSS_8) U2.130(C:VSS_9) ; also sheet 2,3,5
FDCAN1_RX: U2.103(A:PA11) ; also sheet 3
FDCAN1_TX: U2.104(A:PA12) ; also sheet 3
FDCAN2_RX: U2.73(A:PB12) ; also sheet 3
FDCAN2_TX: U2.74(A:PB13) ; also sheet 3
GPIO0: U2.135(A:PB5) ; also sheet 2
GPIO1: U2.129(B:PG14) ; also sheet 2
GPIO2: U2.22(B:PF10) ; also sheet 2
GPIO3: U2.20(B:PF8) ; also sheet 2
GPIO4: U2.19(B:PF7) ; also sheet 2
GPIO5: U2.18(B:PF6) ; also sheet 2
GPIO6: U2.100(A:PA8) ; also sheet 2
GPIO7: U2.99(A:PC9) ; also sheet 2
GPIO8: U2.75(A:PB14) ; also sheet 2
GPIO9: U2.76(A:PB15) ; also sheet 2
GPIO10: U2.127(B:PG12) ; also sheet 2
GPIO11: U2.122(A:PD6) ; also sheet 2
GPIO12: U2.117(A:PD3) ; also sheet 2
GPIO13: U2.116(A:PD2) ; also sheet 2
GPIO14: U2.113(A:PC12) ; also sheet 2
GPIO15: U2.102(A:PA10) ; also sheet 2
GPIO16: U2.101(A:PA9) ; also sheet 2
GPIO17: U2.98(A:PC8) ; also sheet 2
GPIO18: U2.48(A:PB2) ; also sheet 2
GPIO19: U2.41(A:PA5) ; also sheet 2
GPIO20: U2.124(B:PG9) ; also sheet 2
GPIO21: U2.123(A:PD7) ; also sheet 2
GPIO22: U2.126(B:PG11) ; also sheet 2
GPIO23: U2.125(B:PG10) ; also sheet 2
GPIO24: U2.140(A:PB9) ; also sheet 2
GPIO25: U2.139(A:PB8) ; also sheet 2
GPIO26: U2.132(B:PG15) ; also sheet 2
GPIO27: U2.70(A:PB11) ; also sheet 2
GPIO28: U2.69(A:PB10) ; also sheet 2
GPIO29: U2.137(A:PB7) ; also sheet 2
GPIO30: U2.136(A:PB6) ; also sheet 2
JTDO-SWO: U2.133(A:PB3) ; also sheet 3
JTRST: R88.2 TP13.P$1 U2.134(A:PB4)
LED1: U2.91(B:PG6) ; also sheet 2
LED2: U2.92(B:PG7) ; also sheet 2
LED3: U2.93(B:PG8) ; also sheet 2
N$2: C26.1 R4.1 U2.95(C:VDD33USB)
N$6: FB1.2 R8.1
N$8: C25.1 C29.1 FB2.1 U2.33(C:VDDA)
N$11: C4.1 U2.106(C:VCAP2)
N$13: C3.1 U2.71(C:VCAP1)
N$18: R15.2 U2.25(B:NRST)
N$19: D2.1 D3.1 R14.2 R86.2
N$24: R5.2 U2.143(B:PDR_ON)
N$31: C1.1 R15.1 R86.1
PPS: U2.7(A:PC13) ; also sheet 2
RCC_OSC32_IN: U2.8(A:PC14-OSC32_IN) ; also sheet 5
RCC_OSC32_OUT: U2.9(A:PC15-OSC32_OUT) ; also sheet 5
RCC_OSC_IN: U2.23(B:PH0-OSC_IN) ; also sheet 5
RCC_OSC_OUT: U2.24(B:PH1-OSC_OUT) ; also sheet 5
T_JTCK/SWCLK: U2.109(A:PA14) ; also sheet 2,3
T_JTDI: U2.110(A:PA15) ; also sheet 2,3
T_JTMS/SWDIO: U2.105(A:PA13) ; also sheet 2,3
T_NRST: D2.3 ; also sheet 2
T_USART3_RX: U2.112(A:PC11) ; also sheet 2,3
UART4_RX: U2.35(A:PA1) ; also sheet 2,3
UART4_TXB: U2.34(A:PA0-WKUP) ; also sheet 3
USART2_RX: U2.37(A:PA3) ; also sheet 2,3
USART2_TXB: U2.36(A:PA2) ; also sheet 3
USART3_TX: U2.111(A:PC10) ; also sheet 3
VREF+ [Vref]: C27.1 C28.1 FB1.1 U2.32(C:VREF+) ; also sheet 2,3
Unconnected: D2.2 D3.2 U2.21(B:PF9) U2.40(A:PA4) U2.43(A:PA7) U2.46(A:PB0) U2.128(B:PG13)

### Buses
SRAM:A0,A1,A2,A3,A4,A5,A6,A7,A8,A9,A10,A11,A12,A13,A14,A15,A16,A17,A18,A19,A20,A21,A22,A23,A24,/CE0,/CE1,/CE2,/CE3,/CE4,/CE5,/CE6,/CE7,/CE8,/CE9,D0,D1,D2,D3,D4,D5,D6,D7,D8,D9,D10,D11,D12,D13,D14,D15,/E1,/LB,/OE,/UB,/WE

### Notes on the sheet
- MCU
- STM32 IO Pins
- N/C
- MCU reset
  "Wire OR"
- N/C
- N/C
- N/C
- JTAG Reset
  (MCU has int pull up)
- STM32 Power Pins
- Decoupling for MCU VDD pins, including VBAT.
- R8=0R: VDD is Vref
  R8=n/f: Internal Vref is used
  (max drive 4mA)
  NB, MCU registers must
  be set accordingly
- KM
- VA
- 02 NOV 2022
- Place VCAP capacitors near
  MCU pins. (Must be low ESR)
- creative
  commons
- CC
- KS-SCH-01466
- OPEN
  SOURCE
  SATELLITE
- 01
- Open Source Satellite

## Sheet 5 of 6: MRAM & OSCILLATORS
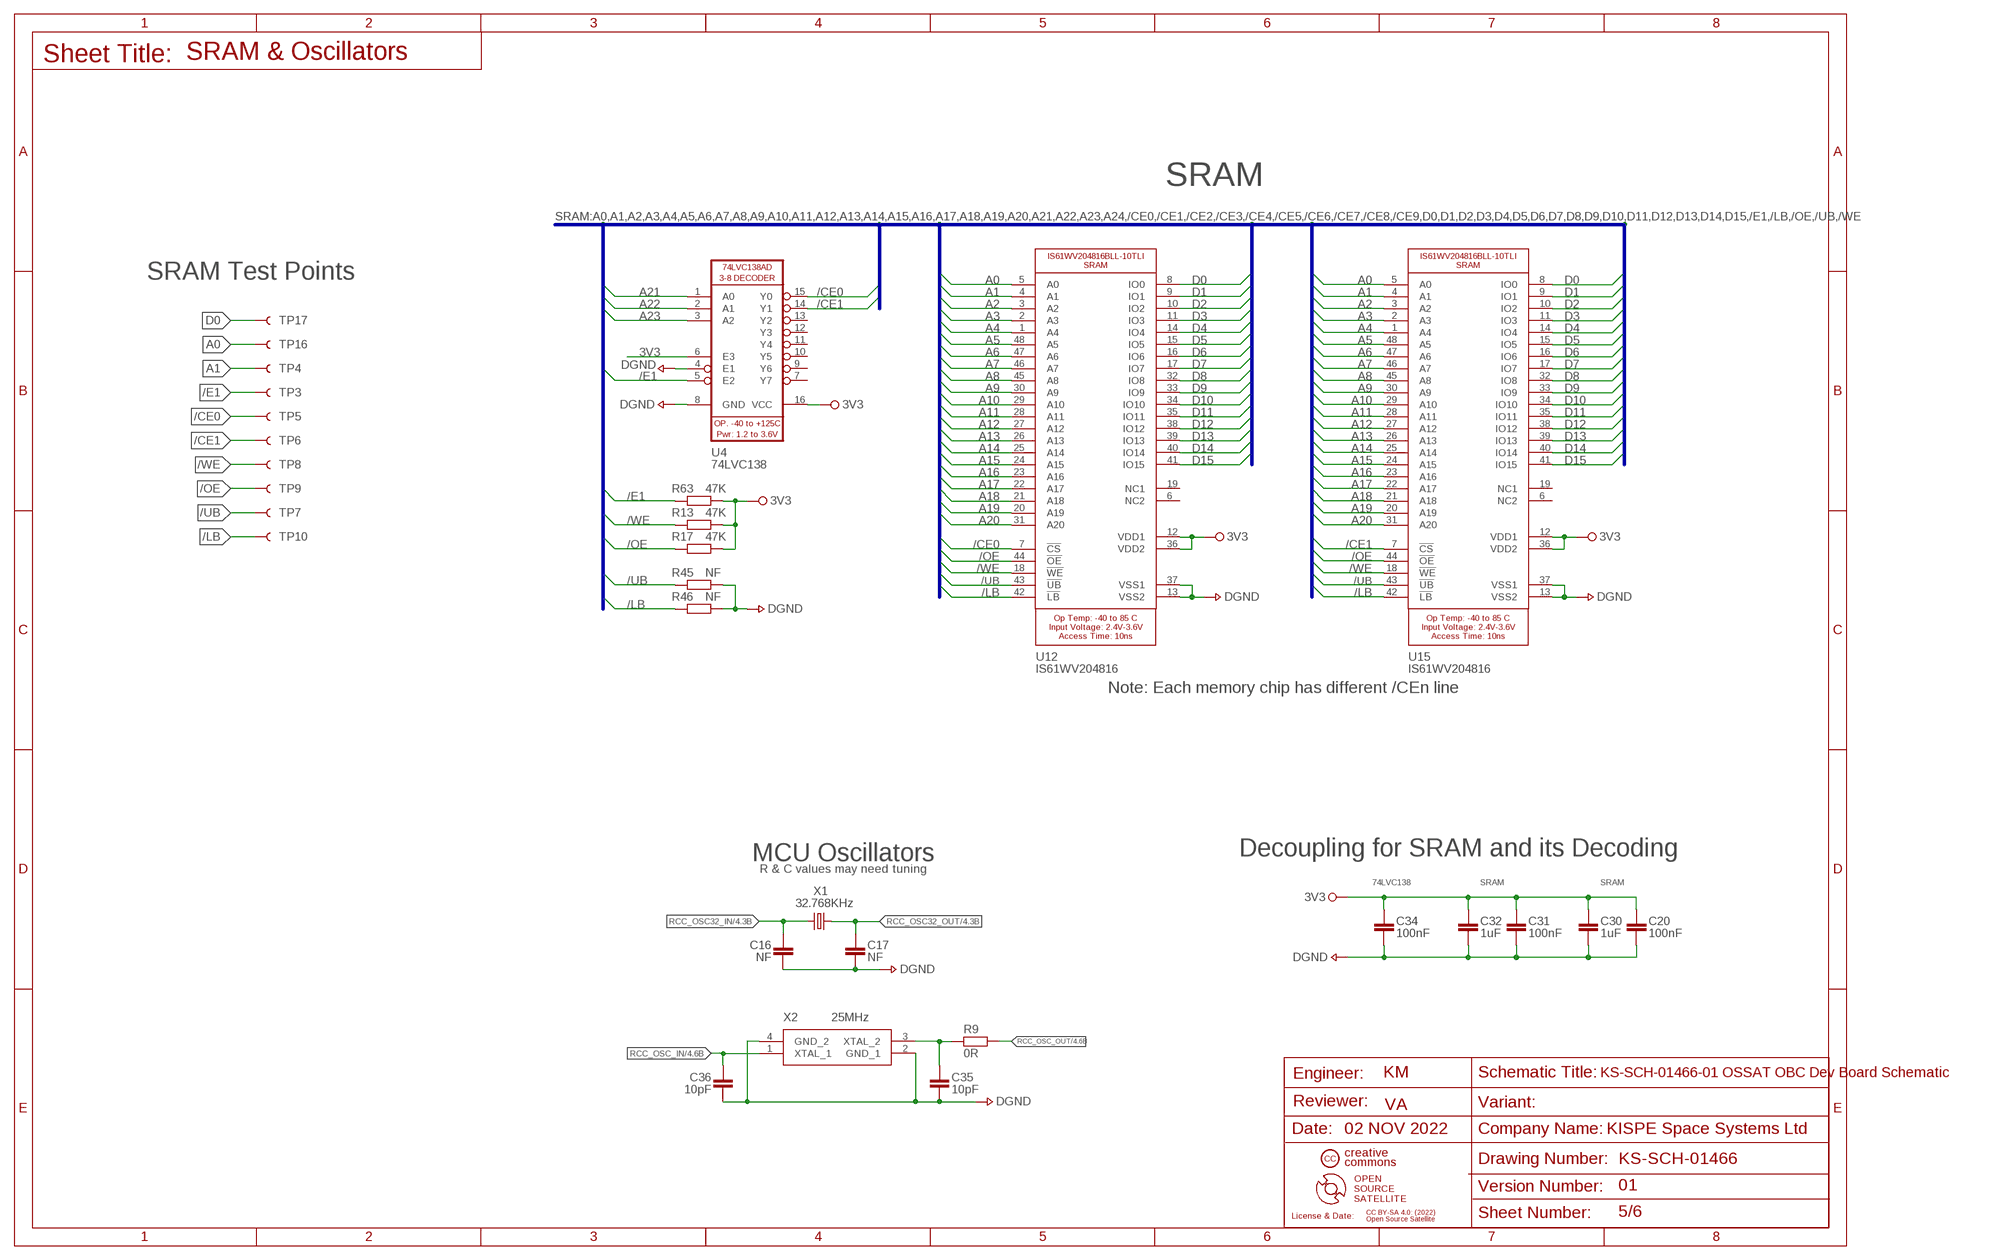
[diagram p4: schematic, sheet 5]
FRAME5 (FRAME_A3_KISPE): LICENSE_DATE: CC BY-SA 4.0: (2022)

### Parts
C16  NF  CAPA103A_MLCC_0805_COG_50V_10%  [CAP_CHIP_0805]
C17  NF  CAPA103A_MLCC_0805_COG_50V_10%  [CAP_CHIP_0805]
C20  100nF  CAPC104A_MLCC_0805_X7R_50V_10%  [CAP_CHIP_0805]
C30  1uF  CAPD101A_MLCC_0805_X7R_25V_10%  [CAP_CHIP_0805]
C31  100nF  CAPC104A_MLCC_0805_X7R_50V_10%  [CAP_CHIP_0805]
C32  1uF  CAPD101A_MLCC_0805_X7R_25V_10%  [CAP_CHIP_0805]
C34  100nF  CAPC104A_MLCC_0805_X7R_50V_10%  [CAP_CHIP_0805]
C35  10pF  CAPA102B_MLCC_0805_COG_50V_5%_Q200  [CAP_CHIP_0805]
C36  10pF  CAPA102B_MLCC_0805_COG_50V_5%_Q200  [CAP_CHIP_0805]
R9  0R  RESA101A_RES_0805_LINK_2A  [RES_CHIP_0805]
R13  47K  RESA103B_RES_0805_0.125W_1%_AEC-Q200  [RES_CHIP_0805]
R17  47K  RESA103B_RES_0805_0.125W_1%_AEC-Q200  [RES_CHIP_0805]
R45  NF  RESA103B_RES_0805_0.125W_1%_AEC-Q200  [RES_CHIP_0805]
R46  NF  RESA103B_RES_0805_0.125W_1%_AEC-Q200  [RES_CHIP_0805]
R63  47K  RESA103B_RES_0805_0.125W_1%_AEC-Q200  [RES_CHIP_0805]
TP3  NF  CNRT101A_TEST-POINT_1.02MM_PTH  [TP-40TH]
TP4  NF  CNRT101A_TEST-POINT_1.02MM_PTH  [TP-40TH]
TP5  NF  CNRT101A_TEST-POINT_1.02MM_PTH  [TP-40TH]
TP6  NF  CNRT101A_TEST-POINT_1.02MM_PTH  [TP-40TH]
TP7  NF  CNRT101A_TEST-POINT_1.02MM_PTH  [TP-40TH]
TP8  NF  CNRT101A_TEST-POINT_1.02MM_PTH  [TP-40TH]
TP9  NF  CNRT101A_TEST-POINT_1.02MM_PTH  [TP-40TH]
TP10  NF  CNRT101A_TEST-POINT_1.02MM_PTH  [TP-40TH]
TP16  NF  CNRT101A_TEST-POINT_1.02MM_PTH  [TP-40TH]
TP17  NF  CNRT101A_TEST-POINT_1.02MM_PTH  [TP-40TH]
U4  ICTL100A_74LVC138AD_3-8_DECODER  [SOIC-16]
U12  ICTM101A_IS61WV204816BLL-10TLI_SRAM_4MBYTE  [IS61WV204816BLL-10TLI]
U15  ICTM101A_IS61WV204816BLL-10TLI_SRAM_4MBYTE  [IS61WV204816BLL-10TLI]
X1  OSCC100A_XTAL_32.768KHZ_12P5  [XTAL_NX3215SA]
X2  OSCC102A_XTAL_25MHZ_10PF  [XTAL_NX2016SA]

### Nets
3V3: C20.1 C30.1 C31.1 C32.1 C34.1 R13.2 R17.2 R63.2 U4.6(E3) U4.16(VCC) U12.12(VDD1) U12.36(VDD2) U15.12(VDD1) U15.36(VDD2) ; also sheet 2,3,4
/CE0 [MRAM Bus]: TP5.P$1 U4.15(Y0) U12.7(!CS)
/CE1 [MRAM Bus]: TP6.P$1 U4.14(Y1) U15.7(!CS)
/E1 [MRAM Bus]: R63.1 TP3.P$1 U4.5(E2) ; also sheet 4
/LB [MRAM Bus]: R46.1 TP10.P$1 U12.42(!LB) U15.42(!LB) ; also sheet 4
/OE [MRAM Bus]: R17.1 TP9.P$1 U12.44(!OE) U15.44(!OE) ; also sheet 4
/UB [MRAM Bus]: R45.1 TP7.P$1 U12.43(!UB) U15.43(!UB) ; also sheet 4
/WE [MRAM Bus]: R13.1 TP8.P$1 U12.18(!WE) U15.18(!WE) ; also sheet 4
A0 [MRAM Bus]: TP16.P$1 U12.5(A0) U15.5(A0) ; also sheet 4
A1 [MRAM Bus]: TP4.P$1 U12.4(A1) U15.4(A1) ; also sheet 4
A2 [MRAM Bus]: U12.3(A2) U15.3(A2) ; also sheet 4
A3 [MRAM Bus]: U12.2(A3) U15.2(A3) ; also sheet 4
A4 [MRAM Bus]: U12.1(A4) U15.1(A4) ; also sheet 4
A5 [MRAM Bus]: U12.48(A5) U15.48(A5) ; also sheet 4
A6 [MRAM Bus]: U12.47(A6) U15.47(A6) ; also sheet 4
A7 [MRAM Bus]: U12.46(A7) U15.46(A7) ; also sheet 4
A8 [MRAM Bus]: U12.45(A8) U15.45(A8) ; also sheet 4
A9 [MRAM Bus]: U12.30(A9) U15.30(A9) ; also sheet 4
A10 [MRAM Bus]: U12.29(A10) U15.29(A10) ; also sheet 4
A11 [MRAM Bus]: U12.28(A11) U15.28(A11) ; also sheet 4
A12 [MRAM Bus]: U12.27(A12) U15.27(A12) ; also sheet 4
A13 [MRAM Bus]: U12.26(A13) U15.26(A13) ; also sheet 4
A14 [MRAM Bus]: U12.25(A14) U15.25(A14) ; also sheet 4
A15 [MRAM Bus]: U12.24(A15) U15.24(A15) ; also sheet 4
A16 [MRAM Bus]: U12.23(A16) U15.23(A16) ; also sheet 4
A17 [MRAM Bus]: U12.22(A17) U15.22(A17) ; also sheet 4
A18 [MRAM Bus]: U12.21(A18) U15.21(A18) ; also sheet 4
A19 [MRAM Bus]: U12.20(A19) U15.20(A19) ; also sheet 4
A20 [MRAM Bus]: U12.31(A20) U15.31(A20) ; also sheet 4
A21 [MRAM Bus]: U4.1(A0) ; also sheet 4
A22 [MRAM Bus]: U4.2(A1) ; also sheet 4
A23 [MRAM Bus]: U4.3(A2) ; also sheet 4
D0 [MRAM Bus]: TP17.P$1 U12.8(IO0) U15.8(IO0) ; also sheet 4
D1 [MRAM Bus]: U12.9(IO1) U15.9(IO1) ; also sheet 4
D2 [MRAM Bus]: U12.10(IO2) U15.10(IO2) ; also sheet 4
D3 [MRAM Bus]: U12.11(IO3) U15.11(IO3) ; also sheet 4
D4 [MRAM Bus]: U12.14(IO4) U15.14(IO4) ; also sheet 4
D5 [MRAM Bus]: U12.15(IO5) U15.15(IO5) ; also sheet 4
D6 [MRAM Bus]: U12.16(IO6) U15.16(IO6) ; also sheet 4
D7 [MRAM Bus]: U12.17(IO7) U15.17(IO7) ; also sheet 4
D8 [MRAM Bus]: U12.32(IO8) U15.32(IO8) ; also sheet 4
D9 [MRAM Bus]: U12.33(IO9) U15.33(IO9) ; also sheet 4
D10 [MRAM Bus]: U12.34(IO10) U15.34(IO10) ; also sheet 4
D11 [MRAM Bus]: U12.35(IO11) U15.35(IO11) ; also sheet 4
D12 [MRAM Bus]: U12.38(IO12) U15.38(IO12) ; also sheet 4
D13 [MRAM Bus]: U12.39(IO13) U15.39(IO13) ; also sheet 4
D14 [MRAM Bus]: U12.40(IO14) U15.40(IO14) ; also sheet 4
D15 [MRAM Bus]: U12.41(IO15) U15.41(IO15) ; also sheet 4
DGND: C16.2 C17.2 C20.2 C30.2 C31.2 C32.2 C34.2 C35.2 C36.2 R45.2 R46.2 U4.4(E1) U4.8(GND) U12.13(VSS2) U12.37(VSS1) U15.13(VSS2) U15.37(VSS1) X2.2(GND_1) X2.4(GND_2) ; also sheet 2,3,4
N$10: C35.1 R9.2 X2.3(XTAL_2)
RCC_OSC32_IN: C16.1 X1.2 ; also sheet 4
RCC_OSC32_OUT: C17.1 X1.1 ; also sheet 4
RCC_OSC_IN: C36.1 X2.1(XTAL_1) ; also sheet 4
RCC_OSC_OUT: R9.1 ; also sheet 4
Unconnected: U4.7(Y7) U4.9(Y6) U4.10(Y5) U4.11(Y4) U4.12(Y3) U4.13(Y2) U12.6(NC2) U12.19(NC1) U15.6(NC2) U15.19(NC1)

### Buses
SRAM:A0,A1,A2,A3,A4,A5,A6,A7,A8,A9,A10,A11,A12,A13,A14,A15,A16,A17,A18,A19,A20,A21,A22,A23,A24,/CE0,/CE1,/CE2,/CE3,/CE4,/CE5,/CE6,/CE7,/CE8,/CE9,D0,D1,D2,D3,D4,D5,D6,D7,D8,D9,D10,D11,D12,D13,D14,D15,/E1,/LB,/OE,/UB,/WE

### Notes on the sheet
- SRAM & Oscillators
- SRAM
- SRAM Test Points
- Note: Each memory chip has different /CEn line
- MCU Oscillators | Decoupling for SRAM and its Decoding
- R & C values may need tuning
- 74LVC138 | SRAM | SRAM
- KM
- VA
- 02 NOV 2022
- creative
  commons
- CC
- KS-SCH-01466
- OPEN
  SOURCE
  SATELLITE
- 01
- Open Source Satellite

## Sheet 6 of 6: Revision History
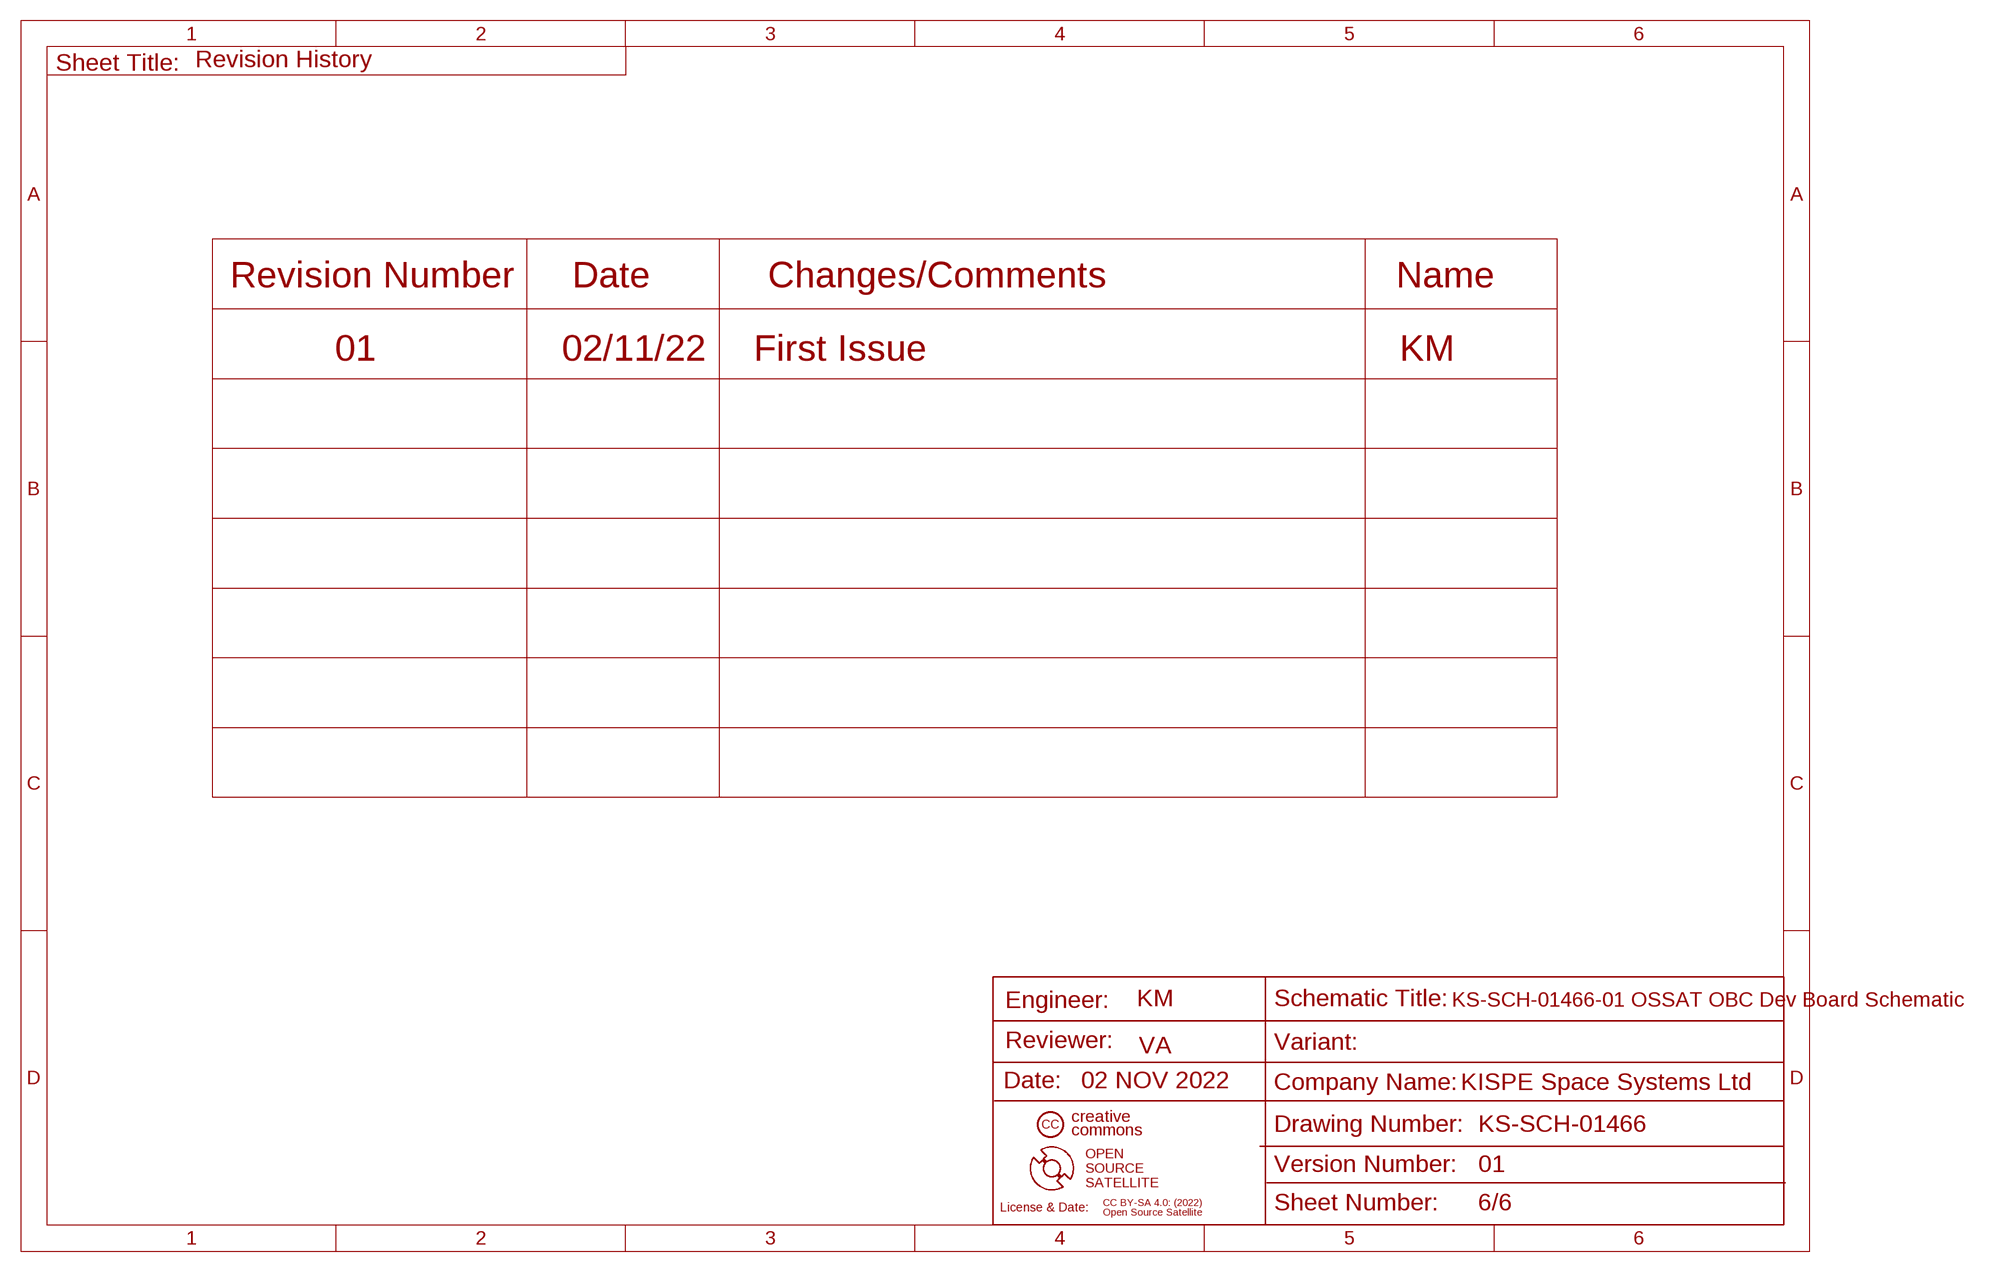
[diagram p5: schematic, sheet 6]
FRAME3 (FRAME_A4_KISPE): LICENSE_DATE: CC BY-SA 4.0: (2022)

### Notes on the sheet
- Revision History
- Revision Number | Date | Changes/Comments | Name
- 01 | 02/11/22 | First Issue | KM
- KM
- VA
- 02 NOV 2022
- creative
  commons
- CC
- KS-SCH-01466
- OPEN
  SOURCE
  SATELLITE
- 01
- Open Source Satellite

## Library data of the parts
C1 C6-C15 C18-C20 C25 C26 C28 C31 C34 C37-C39 C48 C63 = KSP-CAP:CAPC104A: MLCC 0805 X7R 50V 10%
C2 C21-C23 = KSP-CAP:CAPD113A: MLCC 1210 X7R 10V 10%
C3 C4 = KSP-CAP:CAPD102B: MLCC 0805 X7R 16V 10% Q200
C5 = KSP-CAP:CAPD102A: MLCC 0805 X7R 16V 10%
C16 C17 = KSP-CAP:CAPA103A: MLCC 0805 COG 50V 10%
C24 C49 = KSP-CAP:CAPC104B: MLCC 0805 X7R 50V 10% Q200
C27 C29 C30 C32 C40-C47 = KSP-CAP:CAPD101A: MLCC 0805 X7R 25V 10%
C35 C36 = KSP-CAP:CAPA102B: MLCC 0805 COG 50V 5% Q200
C57 = KSP-CAP:CAPI100A: ELECTROLYTIC 16V 20% PTH 10Dx12.5Hx5P Rubycon YXF
C58 = KSP-CAP:CAPA102A: MLCC 0805 COG 50V 5%
C64 = KSP-CAP:CAPD111B: MLCC 1210 X7R 25V 10% Q200
D1 D4 = KSP-TVS:TVSD100A: TVS CDSOD323-Tnn 350W; TYPE: CDSOD323
D2 D3 D9-D11 = KSP-DIO:DIOC100A: BAT54S Dual Schottky SOT23 diodes in series; TYPE: BAT54S
FB1 FB2 = KSP-MAG:MAGB100A: Bead 0805 600R at 100MHz WE-CBF-SMD; TYPE: BEAD
H1-H6 = KSP-MIS:MISH100A: HOLE PTH 3.2 & 6.35; TYPE: 3.2D & 6.35
J1 = KSP-CNR:CNRP101A: 2 Row Micro Header 1.27p Samtec FTSH-1nn-01-F-D-K; TYPE: 2 ROW MICRO HDR
J3 J4 = KSP-CNR:CNRP100A: 2 Row Skt-Strip 2.54P Samtec ESQ-nnn-12-G-D; TYPE: 2 ROW SKT-STRIP
J6 = KSP-CNR:CNRP105A: Micro-USB 90deg Amphenol 10103594-0001LF; TYPE: MICRO-USB
J7 J8 = KSP-CNR:CNRP102A: D-Sub Vert Scw-Post Amphenol FCI DELTA-D; TYPE: D-SUB
LED1-LED5 = KSP-OPT:OPTL102A: LED Yellow 0805 120deg 590nm 150mcd; TYPE: LED YEL
R1-R3 R10-R12 = KSP-RES:RESB100B: RES 4-isolated 1206 1% Q200; TYPE: 4 PACK ISOL
R4 R8 R9 R25 R28 = KSP-RES:RESA101A: RES 0805 LINK 2A
R5 R6 R13-R17 R19-R24 R26 R27 R29 R30 R35-R46 R63 R65 R78 R79 R81-R89 = KSP-RES:RESA103B: RES 0805 0.125W 1% AEC-Q200
S1-S3 = KSP-SWT:SWTA100A: 1PST SMD Momentary push-button 12V 50mA; TYPE: 1PST Mom
TP1-TP17 = KSP-CNR:CNRT101A: Test-Point 1.02mm PTH No part fitted; TYPE: TEST POINT PTH
U2 = KSP-ICT:ICTP100A: STM32H753ZIT6 MCU 144pin Max 85C; TYPE: STM32H753ZIT6
U4 = KSP-ICT:ICTL100A: 74LVC138AD 3-8 decoder SOIC16 Max 125C; TYPE: 74LVC138
U10 U11 = KSP-ICT:ICTT100A: MAX33054EASA+ CAN-Tranceiver SOIC8 Max 125C; TYPE: MAX33054
U12 U15 = KSP-ICT:ICTM101A: IS61WV204816BLL-10TLI SRAM 4MByte (2Mx16) 48pin-TSOP Max 85C; TYPE: IS61WV204816
U13 = KSP-ICT:ICTR100A: LFnnABV LDO Regulator TO-220 Max 125C; TYPE: LFnnABV
X1 = KSP-OSC:OSCC100A: Xtal 32.768KHz 12p5 Max 125c Size 3.2x1.5x0.8; TYPE: 32.768KHz
X2 = KSP-OSC:OSCC102A: Xtal 25MHz 10pF Max 125c Size 2.0x1.6x0.45; TYPE: 25MHz

## Net classes
0 default: width 0.203 mm, drill 0.305 mm
1 MRAM Bus: width 0.152 mm, drill 0.305 mm
2 lvds: width 0.381 mm, clearance 0.152 mm to class 0, clearance 0.152 mm to class 1, clearance 0.152 mm
4 Vref: width 0.305 mm, drill 0.508 mm, clearance 0.279 mm to class 0, clearance 0.279 mm to class 1, clearance 0.279 mm to class 2, clearance 0.279 mm to class 3, clearance 0.279 mm